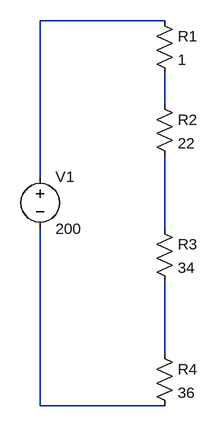
[diagram p0: schematic 4series.asc]
4series.asc, the LTspice schematic file:
Version 4
SHEET 1 880 680
WIRE 320 -96 128 -96
WIRE 320 32 320 -16
WIRE 128 144 128 -96
WIRE 320 224 320 112
WIRE 320 416 320 304
WIRE 128 496 128 224
WIRE 320 496 128 496
SYMBOL voltage 128 128 R0
WINDOW 123 0 0 Left 0
WINDOW 39 0 0 Left 0
SYMATTR InstName V1
SYMATTR Value 200
SYMBOL res 304 -112 R0
SYMATTR InstName R1
SYMATTR Value 1
SYMBOL res 304 16 R0
SYMATTR InstName R2
SYMATTR Value 22
SYMBOL res 304 208 R0
SYMATTR InstName R3
SYMATTR Value 34
SYMBOL res 304 400 R0
SYMATTR InstName R4
SYMATTR Value 36

The netlist it stands for:
* 4series.asc
V1 N001 N005 200
R1 N001 N002 1
R2 N002 N003 22
R3 N003 N004 34
R4 N004 N005 36
.backanno
.end